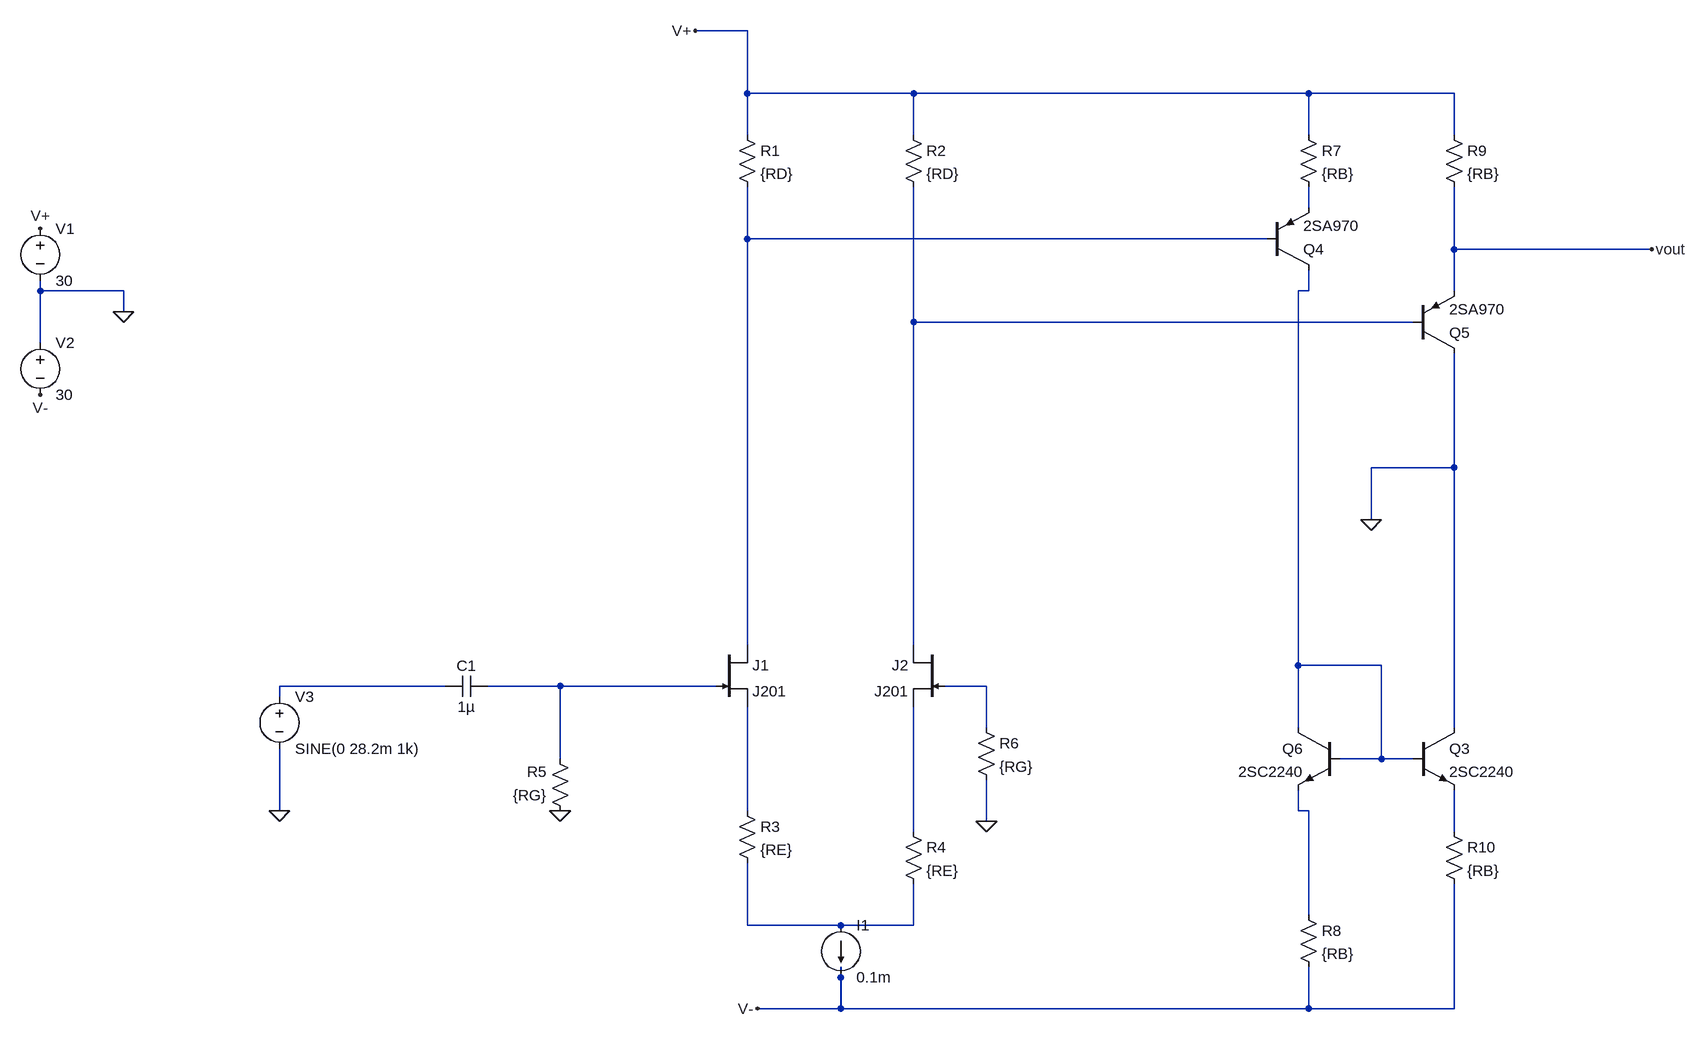
[diagram p0: schematic 1E_JFET_BUFFER_THD.asc]
1E_JFET_BUFFER_THD.asc, the LTspice schematic file:
Version 4
SHEET 1 6468 1752
WIRE 176 -496 96 -496
WIRE 176 -400 176 -496
WIRE 432 -400 176 -400
WIRE 1040 -400 432 -400
WIRE 1264 -400 1040 -400
WIRE 176 -336 176 -400
WIRE 432 -336 432 -400
WIRE 1040 -336 1040 -400
WIRE 1264 -336 1264 -400
WIRE 1040 -224 1040 -256
WIRE 176 -176 176 -256
WIRE 976 -176 176 -176
WIRE 1264 -160 1264 -256
WIRE 1568 -160 1264 -160
WIRE -912 -96 -912 -112
WIRE -784 -96 -912 -96
WIRE 1040 -96 1040 -128
WIRE 1040 -96 1024 -96
WIRE 1264 -96 1264 -160
WIRE -784 -64 -784 -96
WIRE 432 -48 432 -256
WIRE 1200 -48 432 -48
WIRE -912 -16 -912 -96
WIRE 1264 176 1264 0
WIRE 1264 176 1136 176
WIRE 1136 256 1136 176
WIRE 176 448 176 -176
WIRE 432 448 432 -48
WIRE 1024 480 1024 -96
WIRE 1152 480 1024 480
WIRE -288 512 -544 512
WIRE -112 512 -224 512
WIRE 128 512 -112 512
WIRE 544 512 480 512
WIRE -544 528 -544 512
WIRE 544 576 544 512
WIRE 1024 576 1024 480
WIRE 1264 576 1264 176
WIRE -112 624 -112 512
WIRE 1152 624 1152 480
WIRE 1152 624 1088 624
WIRE 1200 624 1152 624
WIRE -544 704 -544 608
WIRE 176 704 176 544
WIRE 1024 704 1024 672
WIRE 1040 704 1024 704
WIRE 544 720 544 656
WIRE 432 736 432 544
WIRE 1264 736 1264 672
WIRE 1040 864 1040 704
WIRE 176 880 176 784
WIRE 320 880 176 880
WIRE 432 880 432 816
WIRE 432 880 320 880
WIRE 320 960 320 944
WIRE 320 1008 320 960
WIRE 320 1008 192 1008
WIRE 1040 1008 1040 944
WIRE 1040 1008 320 1008
WIRE 1264 1008 1264 816
WIRE 1264 1008 1040 1008
FLAG -784 -64 0
FLAG -912 -192 V+
FLAG -912 64 V-
FLAG 544 720 0
FLAG 192 1008 V-
FLAG 96 -496 V+
FLAG -544 704 0
FLAG -112 704 0
FLAG 1136 256 0
FLAG 1568 -160 vout
SYMBOL voltage -912 -208 R0
WINDOW 123 0 0 Left 0
WINDOW 39 0 0 Left 0
SYMATTR InstName V1
SYMATTR Value 30
SYMBOL voltage -912 -32 R0
WINDOW 123 0 0 Left 0
WINDOW 39 0 0 Left 0
SYMATTR InstName V2
SYMATTR Value 30
SYMBOL current 320 880 R0
WINDOW 123 0 0 Left 0
WINDOW 39 0 0 Left 0
SYMATTR InstName I1
SYMATTR Value 0.1m
SYMBOL res 160 -352 R0
SYMATTR InstName R1
SYMATTR Value {RD}
SYMBOL res 416 -352 R0
SYMATTR InstName R2
SYMATTR Value {RD}
SYMBOL res 1024 -352 R0
SYMATTR InstName R7
SYMATTR Value {RB}
SYMBOL res 1248 -352 R0
SYMATTR InstName R9
SYMATTR Value {RB}
SYMBOL res 1024 848 R0
SYMATTR InstName R8
SYMATTR Value {RB}
SYMBOL res 1248 720 R0
SYMATTR InstName R10
SYMATTR Value {RB}
SYMBOL npn 1200 576 R0
SYMATTR InstName Q3
SYMATTR Value 2SC2240
SYMBOL pnp 976 -128 M180
SYMATTR InstName Q4
SYMATTR Value 2SA970
SYMBOL res 160 688 R0
SYMATTR InstName R3
SYMATTR Value {RE}
SYMBOL res 416 720 R0
SYMATTR InstName R4
SYMATTR Value {RE}
SYMBOL res -96 720 R180
WINDOW 0 36 76 Left 2
WINDOW 3 36 40 Left 2
SYMATTR InstName R5
SYMATTR Value {RG}
SYMBOL res 528 560 R0
SYMATTR InstName R6
SYMATTR Value {RG}
SYMBOL pnp 1200 0 M180
SYMATTR InstName Q5
SYMATTR Value 2SA970
SYMBOL npn 1088 576 M0
SYMATTR InstName Q6
SYMATTR Value 2SC2240
SYMBOL voltage -544 512 R0
WINDOW 123 0 0 Left 0
WINDOW 39 0 0 Left 0
SYMATTR InstName V3
SYMATTR Value SINE(0 28.2m 1k)
SYMBOL njf 128 448 R0
SYMATTR InstName J1
SYMATTR Value J201
SYMBOL njf 480 448 M0
SYMATTR InstName J2
SYMATTR Value J201
SYMBOL cap -224 496 R90
WINDOW 0 0 32 VBottom 2
WINDOW 3 32 32 VTop 2
SYMATTR InstName C1
SYMATTR Value 1µ

The netlist it stands for:
* 1E_JFET_BUFFER_THD.asc
V1 V+ 0 30
V2 0 V- 30
I1 N012 V- 0.1m
R1 V+ N002 {RD}
R2 V+ N004 {RD}
R7 V+ N001 {RB}
R9 V+ vout {RB}
R8 N009 V- {RB}
R10 N011 V- {RB}
Q3 0 N003 N011 0 2SC2240
Q4 N003 N002 N001 0 2SA970
R3 N008 N012 {RE}
R4 N010 N012 {RE}
R5 0 N006 {RG}
R6 N007 0 {RG}
Q5 0 N004 vout 0 2SA970
Q6 N003 N003 N009 0 2SC2240
V3 N005 0 SINE(0 28.2m 1k)
J1 N002 N006 N008 J201
J2 N004 N007 N010 J201
C1 N006 N005 1µ
.model NPN NPN
.model PNP PNP
.lib standard.bjt
.model NJF NJF
.model PJF PJF
.lib standard.jft
.backanno
.end